# Altium schematic sheet main.SchDoc
size A2
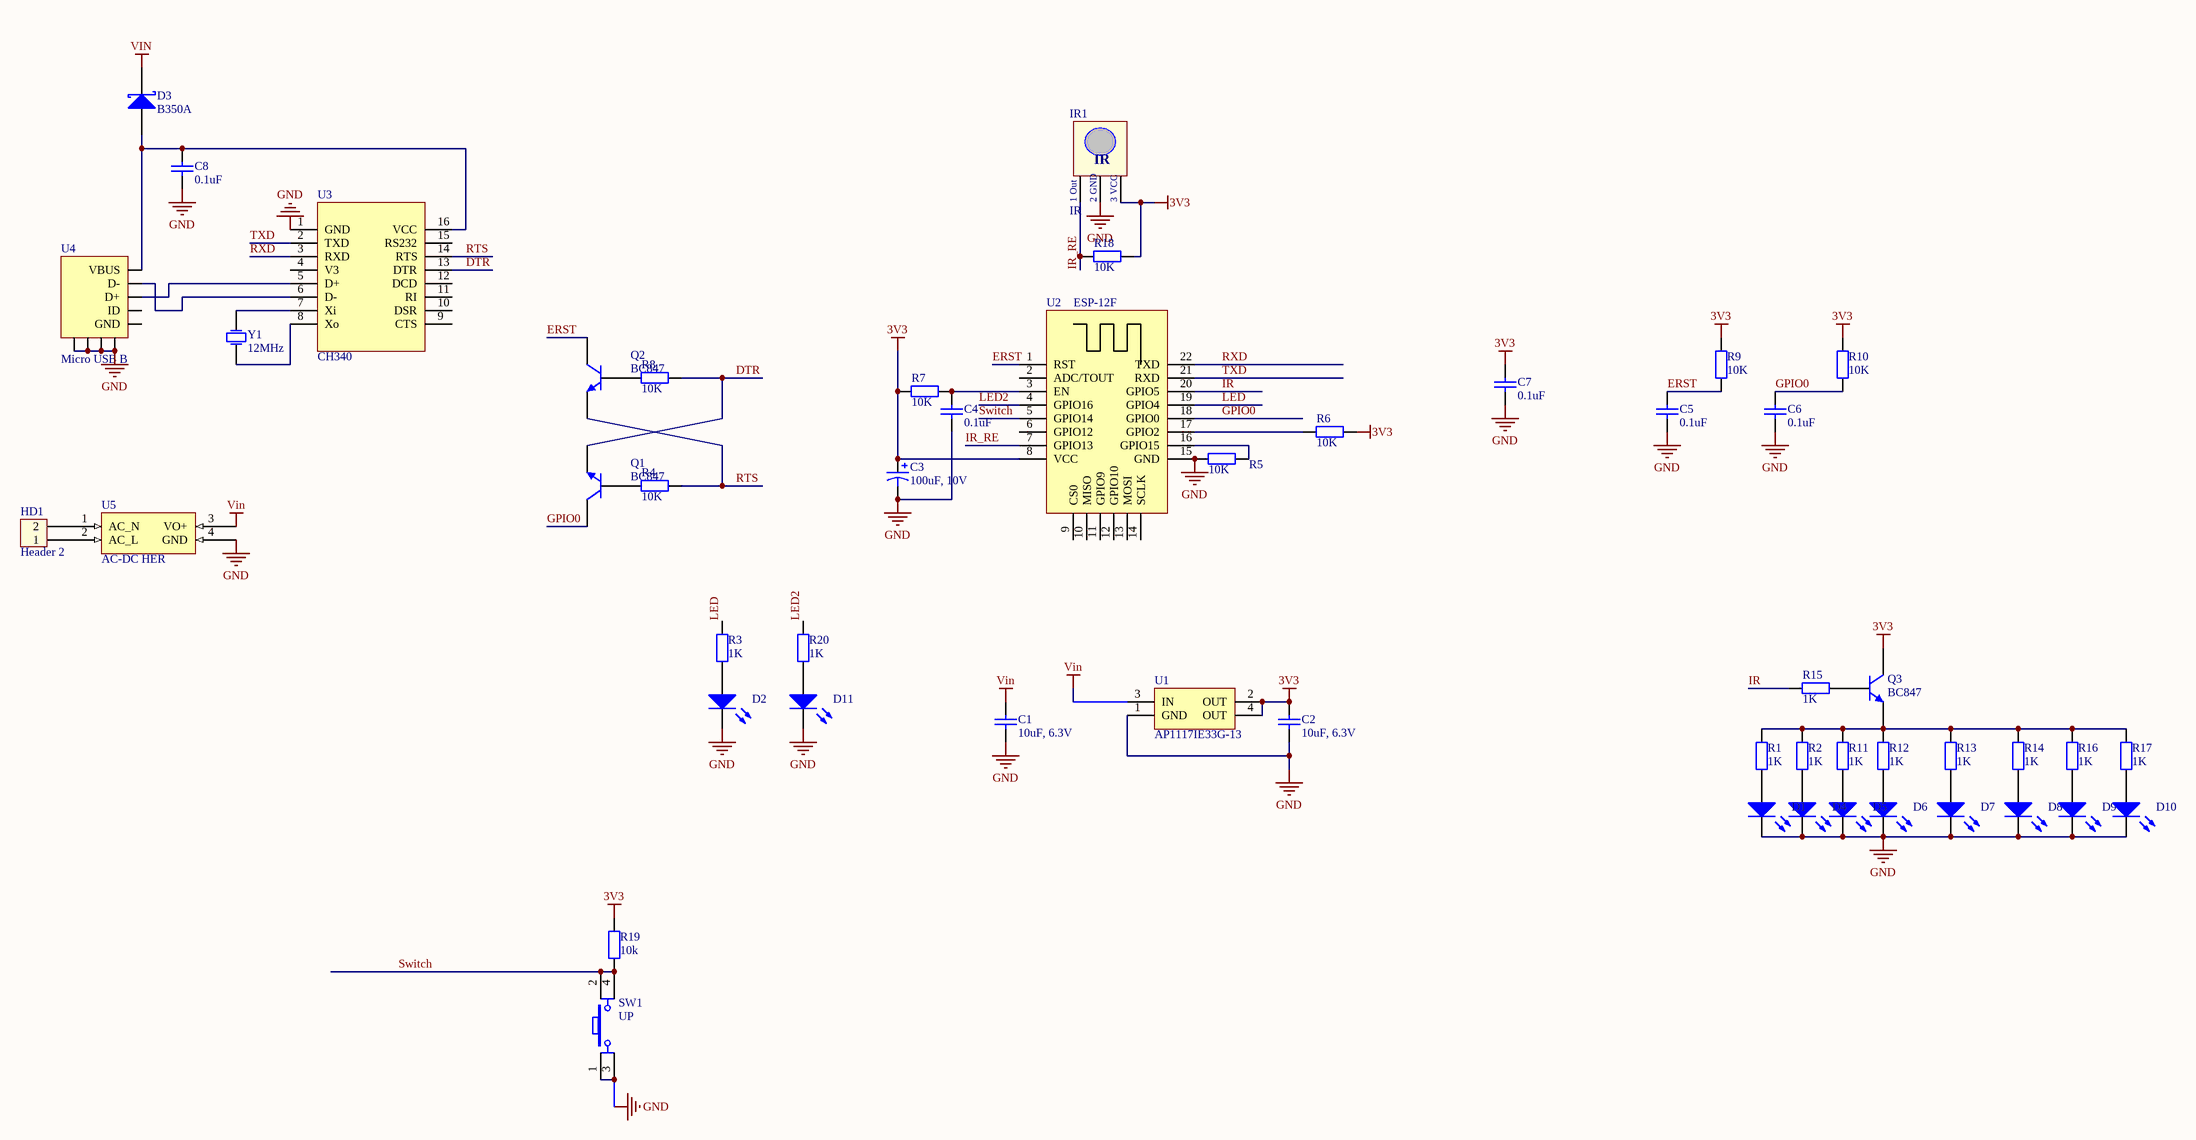
[diagram p0: main.SchDoc]

## Parts
C1  value 10uF, 6.3V  [C0603]  (hidden comment: Ceramic Cap 0603 10uF 6.3V 20% X5R)
C2  value 10uF, 6.3V  [C0603]  (hidden comment: Ceramic Cap 0603 10uF 6.3V 20% X5R)
C3  value 100uF, 10V  [C2917]  (hidden comment: Tantalum Cap 2917 100uF 10V 10% 100 mOhm)
C4  value 0.1uF  [C0603]  (hidden comment: Ceramic Cap 0603 0.1uF 50V 10% X7R)
C5  value 0.1uF  [C0603]  (hidden comment: Ceramic Cap 0603 0.1uF 50V 10% X7R)
C6  value 0.1uF  [C0603]  (hidden comment: Ceramic Cap 0603 0.1uF 50V 10% X7R)
C7  value 0.1uF  [C0603]  (hidden comment: Ceramic Cap 0603 0.1uF 50V 10% X7R)
C8  value 0.1uF  [C0603]  (hidden comment: Ceramic Cap 0603 0.1uF 50V 10% X7R)
D1  LED Red  [LED3mm-R - right angle]  (value not drawn)
D2  LED Green  [LED3mm-G]  (value not drawn)
D3  B350A  [DO-214AC]
D4  LED Red  [LED3mm-R - right angle]  (value not drawn)
D5  LED Red  [LED3mm-R - right angle]  (value not drawn)
D6  LED Red  [LED3mm-R - right angle]  (value not drawn)
D7  LED Red  [LED3mm-R - right angle]  (value not drawn)
D8  LED Red  [LED3mm-R - right angle]  (value not drawn)
D9  LED Red  [LED3mm-R - right angle]  (value not drawn)
D10  LED Red  [LED3mm-R - right angle]  (value not drawn)
D11  LED Green  [LED3mm-G]  (value not drawn)
HD1  Header 2  [HED2]
IR1  IR  [IR]
Q1  BC847  [SOT-23]
Q2  BC847  [SOT-23]
Q3  BC847  [SOT-23]
R1  value 1K  [R0603]  (hidden comment: RES 1K 5% 1/10W 0603)
R2  value 1K  [R0603]  (hidden comment: RES 1K 5% 1/10W 0603)
R3  value 1K  [R0603]  (hidden comment: RES 1K 5% 1/10W 0603)
R4  value 10K  [R0603]  (hidden comment: RES 10K 5% 1/10W 0603)
R5  value 10K  [R0603]  (hidden comment: RES 10K 5% 1/10W 0603)
R6  value 10K  [R0603]  (hidden comment: RES 10K 5% 1/10W 0603)
R7  value 10K  [R0603]  (hidden comment: RES 10K 5% 1/10W 0603)
R8  value 10K  [R0603]  (hidden comment: RES 10K 5% 1/10W 0603)
R9  value 10K  [R0603]  (hidden comment: RES 10K 5% 1/10W 0603)
R10  value 10K  [R0603]  (hidden comment: RES 10K 5% 1/10W 0603)
R11  value 1K  [R0603]  (hidden comment: RES 1K 5% 1/10W 0603)
R12  value 1K  [R0603]  (hidden comment: RES 1K 5% 1/10W 0603)
R13  value 1K  [R0603]  (hidden comment: RES 1K 5% 1/10W 0603)
R14  value 1K  [R0603]  (hidden comment: RES 1K 5% 1/10W 0603)
R15  value 1K  [R0603]  (hidden comment: RES 1K 5% 1/10W 0603)
R16  value 1K  [R0603]  (hidden comment: RES 1K 5% 1/10W 0603)
R17  value 1K  [R0603]  (hidden comment: RES 1K 5% 1/10W 0603)
R18  value 10K  [R0603]  (hidden comment: RES 10K 5% 1/10W 0603)
R19  value 10k  [R0603]  (hidden comment: RES 1K 5% 1/10W 0603)
R20  value 1K  [R0603]  (hidden comment: RES 1K 5% 1/10W 0603)
SW1  UP  [TS-4501S]
U1  AP1117IE33G-13  [SOT-223]
U2  ESP-12F  [ESP-12F]
U3  CH340  [SO-16]
U4  Micro USB B  [USB Micro B - DIP]
U5  AC-DC HER  [ac_dc_hilink]
Y1  value 12MHz  [SMD CRYSTAL CSTCE16M0V53-R0]  (hidden comment: 16MHz 20p Through-hole)

## Nets
3V3: C2.2 C3.1 C7.1 IR1.3(VCC) Q3.3(C) R6.1 R7.2 R9.2 R10.2 R18.1 R19.2 U1.2(OUT) U1.4(OUT) U2.8(VCC)
GND: C1.1 C2.1 C3.2 C4.2 C5.2 C6.2 C7.2 C8.2 D1.2(K) D2.2(K) D4.2(K) D5.2(K) D6.2(K) D7.2(K) D8.2(K) D9.2(K) D10.2(K) D11.2(K) IR1.2(GND) R5.2 SW1.1 SW1.3 U1.1(GND) U2.15(GND) U3.1(GND) U4.SHIELD U5.4(GND)
VIN: C1.2 D3.2(K) U1.3(IN) U5.3(VO+)
DTR: Q1.2(E) R8.1 U3.13(DTR)
ERST: C5.1 Q2.3(C) R9.1 U2.1(RST)
GPIO0: C6.1 Q1.3(C) R10.1 U2.18(GPIO0)
IR: R15.2 U2.20(GPIO5)
IR_RE: IR1.1(Out) R18.2 U2.7(GPIO13)
LED: R3.2 U2.19(GPIO4)
LED2: R20.2 U2.4(GPIO16)
RTS: Q2.2(E) R4.1 U3.14(RTS)
RXD: U2.22(TXD) U3.3(RXD)
Switch: R19.1 SW1.2 SW1.4 U2.5(GPIO14)
TXD: U2.21(RXD) U3.2(TXD)
NetC4_1: C4.1 R7.1 U2.3(EN)
NetC8_1: C8.1 D3.1(A) U3.16(VCC) U4.1(VBUS)
NetD1_1: D1.1(A) R1.1
NetD2_1: D2.1(A) R3.1
NetD4_1: D4.1(A) R2.1
NetD5_1: D5.1(A) R11.1
NetD6_1: D6.1(A) R12.1
NetD7_1: D7.1(A) R13.1
NetD8_1: D8.1(A) R14.1
NetD9_1: D9.1(A) R16.1
NetD10_1: D10.1(A) R17.1
NetD11_1: D11.1(A) R20.1
NetHD1_1: HD1.1 U5.2(AC_L)
NetHD1_2: HD1.2 U5.1(AC_N)
NetQ1_1: Q1.1(B) R4.2
NetQ2_1: Q2.1(B) R8.2
NetQ3_1: Q3.1(B) R15.1
NetQ3_2: Q3.2(E) R1.2 R2.2 R11.2 R12.2 R13.2 R14.2 R16.2 R17.2
NetR5_1: R5.1 U2.16(GPIO15)
NetR6_2: R6.2 U2.17(GPIO2)
NetU3_5: U3.5(D+) U4.3(D+)
NetU3_6: U3.6(D-) U4.2(D-)
NetU3_7: U3.7(Xi) Y1.2(OSC2)
NetU3_8: U3.8(Xo) Y1.1(OSC1)

Not connected (* = marked no-connect by the designer): U2 2(ADC/TOUT) 6(GPIO12) 9(CS0) 10(MISO) 11(GPIO9) 12(GPIO10) 13(MOSI) 14(SCLK); U3 4(V3) 9(CTS) 10(DSR) 11(RI) 12(DCD) 15(RS232); U4 4(ID) 5(GND)

## Notes on the sheet
- Title
- Size:
- Date:
- File:
- A2
- Number:
- Time:
- Revision:
- Sheet
- of
- (in symbol IR) 1 Out; 2 GND; 3 VCC

## Library data of the parts
C1 C2 = GRM188R60J106ME47: Murata General Purpose Ceramic Cap 0603 10uF 6.3V 20% X5R; Supplier 1: Digi-Key; Supplier Part Number 1: 490-3896-1-ND
C3 = TPSD107K010R0100: AVX Tantalum Cap 2917 100uF 10V 10% 100 mOhm; Supplier 1: Digi-Key; Supplier Part Number 1: 478-1777-1-ND
C4-C8 = GRM188R71H104KA93: Murata General Purpose Ceramic Cap 0603 0.1uF 50V 10% X7R; Supplier 1: Digi-Key; Supplier Part Number 1: 490-1519-1-ND
D1 D4-D10 = H100CRD: LED Circuit Board Indicators LED Assmbly Red Single Level 655nm; Supplier 1: Allied; Supplier Part Number 1: 70534889; Value: LED Red
D2 D11 = LTST-C190KGKT: Lite-On LED Green 0603; Supplier Part Number 1: 160-1435-1-ND; Supplier 1: Digi-Key; Value: LED Green
D3 = B350A: Schottky Diode 50V 3A SMA; Supplier 1: Digi-Key; Supplier Part Number 1: B350A-FDICT-ND; Value: B350A
HD1 = Hed2: Header 2 (Green); Value: Header 2
IR1 = IR: Receiver Infraed IC
Q1-Q3 = BC847: TRANS BIPO NPN 200MW 45V SC70-3; Supplier 1: Digi-Key; Value: BC847
  Q1 Q2: Supplier Part Number 1: BC847AW-7FDICT-ND
  Q3: Supplier Part Number 1: BC847C-TPCT-ND; Supplier Part Number 2: FL2901
R1-R3 R11-R17 R19 R20 = RC0603JR-071KL: Yageo RES 1K 5% 1/10W 0603; Supplier 1: Digi-Key; Supplier Part Number 1: 311-1.0KGRCT-ND
R4-R10 R18 = RC0603JR-0710KL: Yageo RES 10K 5% 1/10W 0603; Supplier 1: Digi-Key; Supplier Part Number 1: 311-10KGRCT-ND
SW1 = SW4: Switch button 4 pin; Value: Button chip 4 pin
U1 = AP1117IE33G-13: 1A Low Dropout Positive Regulator 3.3V; Supplier 1: Digi-Key; Supplier Part Number 1: AP1117IE33G-13DICT-ND; Supplier Part Number 2: FL1933; Value: AP1117IE33G-13
U2 = ESP-12F: ESP-12F WiFi Module
U3 = CH340G
U4 = 0473460001: Molex Micro USB B Receptacle Right Angle; Supplier 1: Digi-Key; Supplier Part Number 1: WM17141CT-ND; Value: Micro USB B
Y1 = ATS16A-E: CTS Crystal 16MHz 20pF Through-hole; Supplier Part Number 1: CTX1084-ND; Supplier 1: Digi-Key